# Altium schematic sheet Sheet1.SchDoc
size A4; SheetNumber: 1; SheetTotal: 1
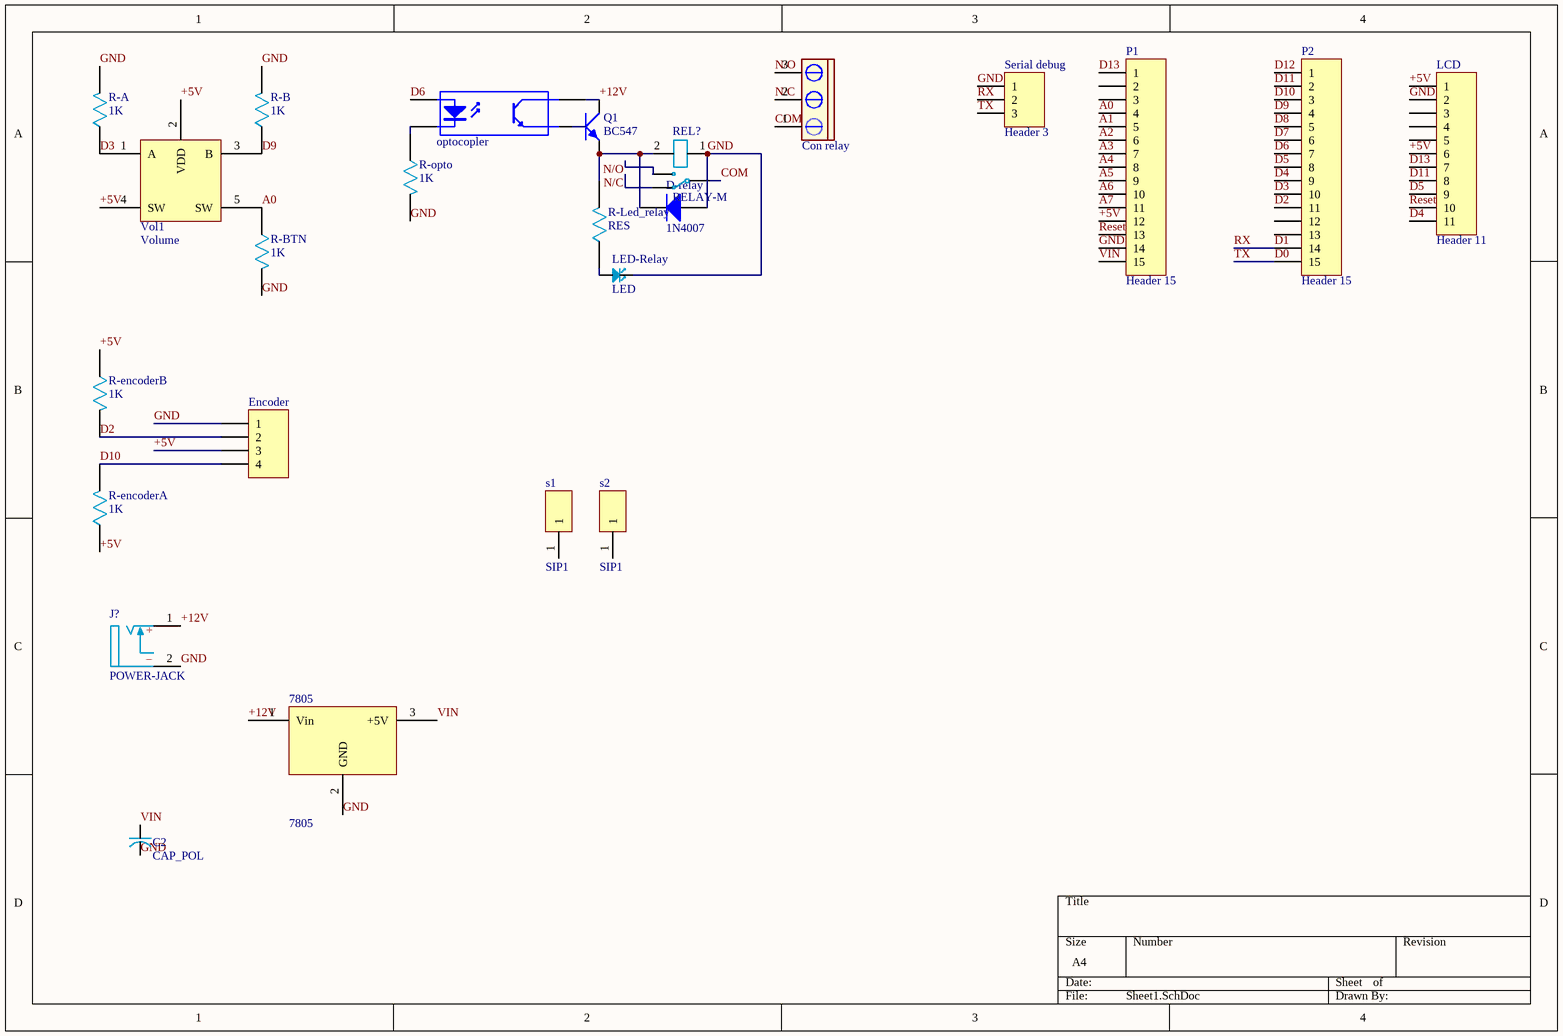
[diagram p0: Sheet1.SchDoc]

## Parts
7805  7805  [My_TO-220]
C2  CAP_POL  [RB.1/.3]
Con_relay  CON3 pin Green  [My_CN3]  (value not drawn)
D-relay  1N4007  [My_DO-41]
Encoder  Header 4  [My_1X04]  (value not drawn)
J?  POWER-JACK  [POWER-JACK]
LCD  Header 11  [HDR1X11]
LED-Relay  LED  [LED_5MM]
optocopler  Optoisolator  [My_opto]  (value not drawn)
P1  Header 15  [HDR1X15]
P2  Header 15  [HDR1X15]
Q1  BC547  [TO92]
R-A  1K  [1206]
R-B  1K  [1206]
R-BTN  1K  [1206]
R-encoderA  1K  [1206]
R-encoderB  1K  [1206]
R-Led_relay  RES  [1206]
R-opto  1K  [1206]
REL?  RELAY-M  [RELAY3]
s1  SIP1  [SIP1]
s2  SIP1  [SIP1]
Serial_debug  Header 3  [HDR1X3]
Vol1  Volume  [rotary Encoder Pot]

## Nets
+5V: Encoder.3 LCD.1 LCD.6 P1.12 R-encoderA.1 R-encoderB.1 Vol1.2(VDD) Vol1.4(SW)
+12V: 7805.1(Vin) J?.1 optocopler.3(C) Q1.1(C)
A0: P1.4 R-BTN.1 Vol1.5(SW)
A1: P1.5
A2: P1.6
A3: P1.7
A4: P1.8
A5: P1.9
A6: P1.10
A7: P1.11
COM: Con_relay.1 REL?.3
D0: P2.15 Serial_debug.3  [also labelled TX]
D1: P2.14 Serial_debug.2  [also labelled RX]
D2: Encoder.2 P2.11 R-encoderB.2
D3: P2.10 R-A.1 Vol1.1(A)
D4: LCD.11 P2.9
D5: LCD.9 P2.8
D6: optocopler.1(A) P2.7
D7: P2.6
D8: P2.5
D9: P2.4 R-B.1 Vol1.3(B)
D10: Encoder.4 P2.3 R-encoderA.2
D11: LCD.8 P2.2
D12: P2.1
D13: LCD.7 P1.1
GND: 7805.2(GND) C2.2 D-relay.A Encoder.1 J?.2 LCD.2 LED-Relay.2 P1.14 R-A.2 R-B.2 R-BTN.2 R-opto.2 REL?.1 Serial_debug.1
N/C: Con_relay.2 REL?.4
N/O: Con_relay.3 REL?.5
Reset: LCD.10 P1.13
VIN: 7805.3(+5V) C2.1 P1.15
NetD-relay_K: D-relay.K Q1.3(E) R-Led_relay.2 REL?.2
NetLED-Relay_1: LED-Relay.1 R-Led_relay.1
Netoptocopler_2: optocopler.2(K) R-opto.1
Netoptocopler_4: optocopler.4(E) Q1.2(B)

Not connected (* = marked no-connect by the designer): LCD 3 4 5; P1 2 3; P2 12 13; s1 1; s2 1

## Notes on the sheet
- (in symbol POWER-JACK) +; _

## Library data of the parts
7805 = 7805: Regulator
Con_relay = CON3 pin Green: Connector green screw
D-relay = 1N4007: 1 Amp Diode
Encoder = Header 4: Header, 4-Pin; LatestRevisionDate: 17-Jul-2002; LatestRevisionNote: Re-released for DXP Platform.; Publisher: Altium Limited
LCD = Header 11: Header, 11-Pin; LatestRevisionDate: 17-Jul-2002; LatestRevisionNote: Re-released for DXP Platform.; Publisher: Altium Limited
P1 P2 = Header 15: Header, 15-Pin; LatestRevisionDate: 17-Jul-2002; LatestRevisionNote: Re-released for DXP Platform.; Publisher: Altium Limited
R-A R-B R-BTN R-encoderA R-encoderB R-opto = RES
Serial_debug = Header 3: Header, 3-Pin; LatestRevisionDate: 17-Jul-2002; LatestRevisionNote: Re-released for DXP Platform.; Publisher: Altium Limited